# Altium schematic sheet FEV-60_Motor_Driver_Mcu.SchDoc
size B
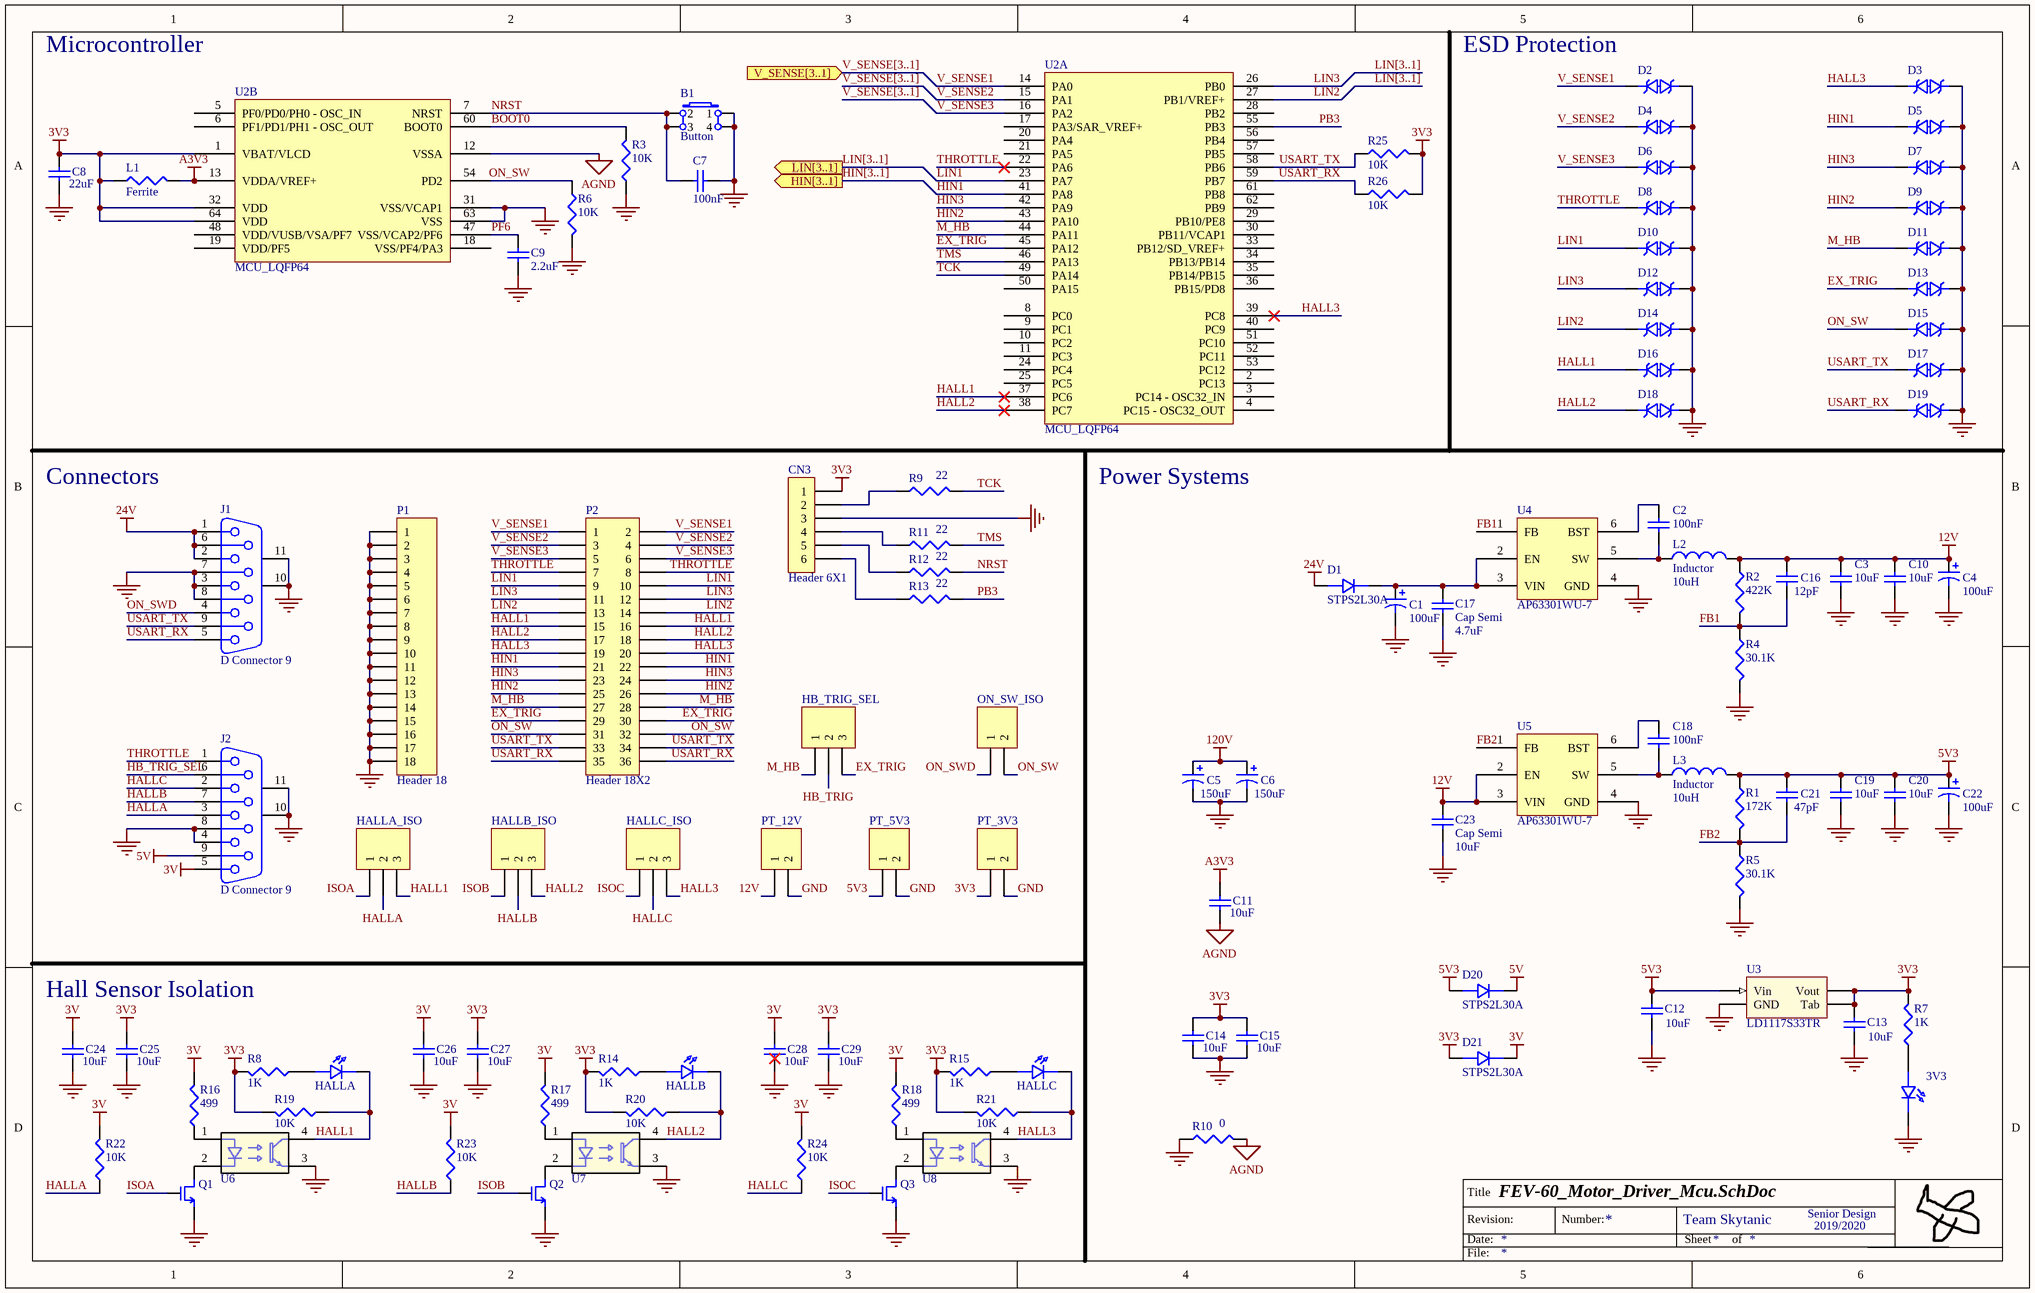
[diagram p0: FEV-60_Motor_Driver_Mcu.SchDoc]

## Parts
3V3  LED-RED-AK-2  [AVAG-HSMX-C190_V]  (value not drawn)
B1  Button  [Button - duplicate]
C1  value 100uF  [UVY1V101MED1TD]  (hidden comment: UVY1V101MED1TD)
C2  value 100nF  [1608[0603]]  (hidden comment: Cap Semi)
C3  value 10uF  [1608[0603]]  (hidden comment: Cap Semi)
C4  value 100uF  [UVY1V101MED1TD]  (hidden comment: UVY1V101MED1TD)
C5  value 150uF  [UCS2D151MHD1TN]  (hidden comment: UCS2D151MHD1TN)
C6  value 150uF  [UCS2D151MHD1TN]  (hidden comment: UCS2D151MHD1TN)
C7  value 100nF  [1608[0603]]  (hidden comment: Cap Semi)
C8  value 22uF  [1608[0603]]  (hidden comment: Cap Semi)
C9  value 2.2uF  [1608[0603]]  (hidden comment: Cap Semi)
C10  value 10uF  [1608[0603]]  (hidden comment: Cap Semi)
C11  value 10uF  [1608[0603]]  (hidden comment: Cap Semi)
C12  value 10uF  [1608[0603]]  (hidden comment: Cap Semi)
C13  value 10uF  [1608[0603]]  (hidden comment: Cap Semi)
C14  value 10uF  [1608[0603]]  (hidden comment: Cap Semi)
C15  value 10uF  [1608[0603]]  (hidden comment: Cap Semi)
C16  value 12pF  [1608[0603]]  (hidden comment: Cap Semi)
C17  Cap Semi  value 4.7uF  [1608[0603]]
C18  value 100nF  [1608[0603]]  (hidden comment: Cap Semi)
C19  value 10uF  [1608[0603]]  (hidden comment: Cap Semi)
C20  value 10uF  [1608[0603]]  (hidden comment: Cap Semi)
C21  value 47pF  [1608[0603]]  (hidden comment: Cap Semi)
C22  value 100uF  [UVY1V101MED1TD]  (hidden comment: UVY1V101MED1TD)
C23  Cap Semi  value 10uF  [1608[0603]]
C24  value 10uF  [1608[0603]]  (hidden comment: Cap Semi)
C25  value 10uF  [1608[0603]]  (hidden comment: Cap Semi)
C26  value 10uF  [1608[0603]]  (hidden comment: Cap Semi)
C27  value 10uF  [1608[0603]]  (hidden comment: Cap Semi)
C28  value 10uF  [1608[0603]]  (hidden comment: Cap Semi)
C29  value 10uF  [1608[0603]]  (hidden comment: Cap Semi)
CN3  Header 6X1  [HDR1X6]
D1  STPS2L30A  [STPS2L30A]
D2  SP1103C-01UTG  [SP1103C-01UTG]  (value not drawn)
D3  SP1103C-01UTG  [SP1103C-01UTG]  (value not drawn)
D4  SP1103C-01UTG  [SP1103C-01UTG]  (value not drawn)
D5  SP1103C-01UTG  [SP1103C-01UTG]  (value not drawn)
D6  SP1103C-01UTG  [SP1103C-01UTG]  (value not drawn)
D7  SP1103C-01UTG  [SP1103C-01UTG]  (value not drawn)
D8  SP1103C-01UTG  [SP1103C-01UTG]  (value not drawn)
D9  SP1103C-01UTG  [SP1103C-01UTG]  (value not drawn)
D10  SP1103C-01UTG  [SP1103C-01UTG]  (value not drawn)
D11  SP1103C-01UTG  [SP1103C-01UTG]  (value not drawn)
D12  SP1103C-01UTG  [SP1103C-01UTG]  (value not drawn)
D13  SP1103C-01UTG  [SP1103C-01UTG]  (value not drawn)
D14  SP1103C-01UTG  [SP1103C-01UTG]  (value not drawn)
D15  SP1103C-01UTG  [SP1103C-01UTG]  (value not drawn)
D16  SP1103C-01UTG  [SP1103C-01UTG]  (value not drawn)
D17  SP1103C-01UTG  [SP1103C-01UTG]  (value not drawn)
D18  SP1103C-01UTG  [SP1103C-01UTG]  (value not drawn)
D19  SP1103C-01UTG  [SP1103C-01UTG]  (value not drawn)
D20  STPS2L30A  [STPS2L30A]
D21  STPS2L30A  [STPS2L30A]
HALLA  LED-RED-AK-2  [AVAG-HSMX-C190_V]  (value not drawn)
HALLA_ISO  Header 3  [HDR1X3]  (value not drawn)
HALLB  LED-RED-AK-2  [AVAG-HSMX-C190_V]  (value not drawn)
HALLB_ISO  Header 3  [HDR1X3]  (value not drawn)
HALLC  LED-RED-AK-2  [AVAG-HSMX-C190_V]  (value not drawn)
HALLC_ISO  Header 3  [HDR1X3]  (value not drawn)
HB_TRIG_SEL  Header 3  [HDR1X3]  (value not drawn)
J1  D Connector 9  [DSUB1.385-2H9]
J2  D Connector 9  [DSUB1.385-2H9]
L1  Ferrite  [J1-0603]
L2  Inductor  value 10uH  [74404084100]
L3  Inductor  value 10uH  [74404084100]
ON_SW_ISO  Header 2  [HDR1X2]  (value not drawn)
P1  Header 18  [HDR1X18]
P2  Header 18X2  [HDR2X18]
PT_3V3  Header 2  [HDR1X2]  (value not drawn)
PT_5V3  Header 2  [HDR1X2]  (value not drawn)
PT_12V  Header 2  [HDR1X2]  (value not drawn)
Q1  RK7002BMT116  [SOT95P240X120-3N]  (value not drawn)
Q2  RK7002BMT116  [SOT95P240X120-3N]  (value not drawn)
Q3  RK7002BMT116  [SOT95P240X120-3N]  (value not drawn)
R1  value 172K  [J1-0603]  (hidden comment: Res3)
R2  value 422K  [J1-0603]  (hidden comment: Res3)
R3  value 10K  [J1-0603]  (hidden comment: Res3)
R4  value 30.1K  [J1-0603]  (hidden comment: Res3)
R5  value 30.1K  [J1-0603]  (hidden comment: Res3)
R6  value 10K  [J1-0603]  (hidden comment: Res3)
R7  value 1K  [J1-0603]  (hidden comment: Res3)
R8  value 1K  [J1-0603]  (hidden comment: Res3)
R9  value 22  [J1-0603]  (hidden comment: Res3)
R10  value 0  [J1-0603]  (hidden comment: Res3)
R11  value 22  [J1-0603]  (hidden comment: Res3)
R12  value 22  [J1-0603]  (hidden comment: Res3)
R13  value 22  [J1-0603]  (hidden comment: Res3)
R14  value 1K  [J1-0603]  (hidden comment: Res3)
R15  value 1K  [J1-0603]  (hidden comment: Res3)
R16  value 499  [J1-0603]  (hidden comment: Res3)
R17  value 499  [J1-0603]  (hidden comment: Res3)
R18  value 499  [J1-0603]  (hidden comment: Res3)
R19  value 10K  [J1-0603]  (hidden comment: Res3)
R20  value 10K  [J1-0603]  (hidden comment: Res3)
R21  value 10K  [J1-0603]  (hidden comment: Res3)
R22  value 10K  [J1-0603]  (hidden comment: Res3)
R23  value 10K  [J1-0603]  (hidden comment: Res3)
R24  value 10K  [J1-0603]  (hidden comment: Res3)
R25  value 10K  [J1-0603]  (hidden comment: Res3)
R26  value 10K  [J1-0603]  (hidden comment: Res3)
U2  MCU_LQFP64  [STM32F030R8 - duplicate]  (parts A,B of 2)
U3  LD1117S33TR  [LD1117S33TR - duplicate]
U4  AP63301WU-7  [AP63301WU-7]
U5  AP63301WU-7  [AP63301WU-7]
U6  TLP291(BLL-TP,SE  [Toshiba_11-11F1_0 - duplicate]  (value not drawn)
U7  TLP291(BLL-TP,SE  [Toshiba_11-11F1_0 - duplicate]  (value not drawn)
U8  TLP291(BLL-TP,SE  [Toshiba_11-11F1_0 - duplicate]  (value not drawn)

## Ports
HIN[3..1] (out), LIN[3..1] (out), V_SENSE[3..1] (in)

## Nets
3V: C24.2 C26.2 C28.2 D21.2(K) J2.5 R16.2 R17.2 R18.2 R22.2 R23.2 R24.2
3V3: C8.2 C13.2 C14.2 C15.2 C25.2 C27.2 C29.2 CN3.1 D21.1(A) L1.1 PT_3V3.1 R7.2 R8.2 R14.2 R15.2 R19.2 R20.2 R21.2 R25.2 R26.2 U2.1(VBAT/VLCD) U2.32(VDD) U2.64(VDD) U3.2(Vout) U3.4(Tab)
5V: D20.2(K) J2.9
5V3: C12.2 C19.2 C20.2 C21.2 C22.1 D20.1(A) L3.2 PT_5V3.1 R1.1 U3.3(Vin)
12V: C3.2 C4.1 C10.2 C16.2 C23.2 L2.2 PT_12V.1 R2.1 U5.2(EN) U5.3(VIN)
24V: D1.1(A) J1.1 J1.2 J1.6
120V: C5.1 C6.1
A3V3: C11.2 L1.2 U2.13(VDDA/VREF+)
AGND: C11.1 R10.2 U2.12(VSSA)
GND: 3V3.2(K) B1.1 B1.4 C1.2 C3.1 C4.2 C5.2 C6.2 C7.1 C8.1 C9.1 C10.1 C12.1 C13.1 C14.1 C15.1 C17.1 C19.1 C20.1 C22.2 C23.1 C24.1 C25.1 C26.1 C27.1 C28.1 C29.1 CN3.3 D2.2(K) D3.2(K) D4.2(K) D5.2(K) D6.2(K) D7.2(K) D8.2(K) D9.2(K) D10.2(K) D11.2(K) D12.2(K) D13.2(K) D14.2(K) D15.2(K) D16.2(K) D17.2(K) D18.2(K) D19.2(K) J1.3 J1.7 J1.8 J1.10(MH1) J1.11(MH2) J2.4 J2.8 J2.10(MH1) J2.11(MH2) P1.1 P1.2 P1.3 P1.4 P1.5 P1.6 P1.7 P1.8 P1.9 P1.10 P1.11 P1.12 P1.13 P1.14 P1.15 P1.16 P1.17 P1.18 PT_3V3.2 PT_5V3.2 PT_12V.2 Q1.2(SOURCE) Q2.2(SOURCE) Q3.2(SOURCE) R3.1 R4.2 R5.2 R6.2 R10.1 U2.31(VSS/VCAP1) U2.63(VSS) U3.1(GND) U4.4(GND) U5.4(GND) U6.3(Emmiter) U7.3(Emmiter) U8.3(Emmiter)
BOOT0: R3.2 U2.60(BOOT0)
EX_TRIG: D13.1(A) HB_TRIG_SEL.3 P2.29 P2.30 U2.45(PA12)
FB1: C16.1 R2.2 R4.1 U4.1(FB)
FB2: C21.1 R1.2 R5.1 U5.1(FB)
HALL1: D16.1(A) HALLA.2(K) HALLA_ISO.3 P2.15 P2.16 R19.1 U2.37(PC6) U6.4(Collector)
HALL2: D18.1(A) HALLB.2(K) HALLB_ISO.3 P2.17 P2.18 R20.1 U2.38(PC7) U7.4(Collector)
HALL3: D3.1(A) HALLC.2(K) HALLC_ISO.3 P2.19 P2.20 R21.1 U2.39(PC8) U8.4(Collector)
HALLA: HALLA_ISO.2 J2.3 R22.1
HALLB: HALLB_ISO.2 J2.7 R23.1
HALLC: HALLC_ISO.2 J2.2 R24.1
HB_TRIG: HB_TRIG_SEL.2
HB_TRIG_SEL: J2.6
HIN1: D5.1(A) P2.21 P2.22 U2.41(PA8)
HIN2: D9.1(A) P2.25 P2.26 U2.43(PA10)
HIN3: D7.1(A) P2.23 P2.24 U2.42(PA9)
ISOA: HALLA_ISO.1 Q1.1(GATE)
ISOB: HALLB_ISO.1 Q2.1(GATE)
ISOC: HALLC_ISO.1 Q3.1(GATE)
LIN1: D10.1(A) P2.9 P2.10 U2.23(PA7)
LIN2: D14.1(A) P2.13 P2.14 U2.27(PB1/VREF+)
LIN3: D12.1(A) P2.11 P2.12 U2.26(PB0)
M_HB: D11.1(A) HB_TRIG_SEL.1 P2.27 P2.28 U2.44(PA11)
NRST: B1.2 B1.3 C7.2 R12.2 U2.7(NRST)
ON_SW: D15.1(A) ON_SW_ISO.2 P2.31 P2.32 R6.1 U2.54(PD2)
ON_SWD: J1.4 ON_SW_ISO.1
PB3: R13.2 U2.55(PB3)
PF6: C9.2 U2.47(VSS/VCAP2/PF6)
TCK: R9.2 U2.49(PA14)
THROTTLE: D8.1(A) J2.1 P2.7 P2.8 U2.22(PA6)
TMS: R11.2 U2.46(PA13)
USART_RX: D19.1(A) J1.5 P2.35 P2.36 R26.1 U2.59(PB7)
USART_TX: D17.1(A) J1.9 P2.33 P2.34 R25.1 U2.58(PB6)
V_SENSE1: D2.1(A) P2.1 P2.2 U2.14(PA0)
V_SENSE2: D4.1(A) P2.3 P2.4 U2.15(PA1)
V_SENSE3: D6.1(A) P2.5 P2.6 U2.16(PA2)
Net3V3_1: 3V3.1(A) R7.1
NetC1_1: C1.1 C17.2 D1.2(K) U4.2(EN) U4.3(VIN)
NetC2_1: C2.1 L2.1 U4.5(SW)
NetC2_2: C2.2 U4.6(BST)
NetC18_1: C18.1 L3.1 U5.5(SW)
NetC18_2: C18.2 U5.6(BST)
NetCN3_2: CN3.2 R9.1
NetCN3_4: CN3.4 R11.1
NetCN3_5: CN3.5 R12.1
NetCN3_6: CN3.6 R13.1
NetHALLA_1: HALLA.1(A) R8.1
NetHALLB_1: HALLB.1(A) R14.1
NetHALLC_1: HALLC.1(A) R15.1
NetQ1_3: Q1.3(DRAIN) U6.2(Cathode)
NetQ2_3: Q2.3(DRAIN) U7.2(Cathode)
NetQ3_3: Q3.3(DRAIN) U8.2(Cathode)
NetR16_1: R16.1 U6.1(Anode)
NetR17_1: R17.1 U7.1(Anode)
NetR18_1: R18.1 U8.1(Anode)

Not connected (* = marked no-connect by the designer): U2 2(PC13) 3(PC14_-_OSC32_IN) 4(PC15_-_OSC32_OUT) 5(PF0/PD0/PH0_-_OSC_IN) 6(PF1/PD1/PH1_-_OSC_OUT) 8(PC0) 9(PC1) 10(PC2) 11(PC3) 17(PA3/SAR_VREF+) 18(VSS/PF4/PA3) 19(VDD/PF5) 20(PA4) 21(PA5) 24(PC4) 25(PC5) 28(PB2) 29(PB10/PE8) 30(PB11/VCAP1) 33(PB12/SD_VREF+) 34(PB13/PB14) 35(PB14/PB15) 36(PB15/PD8) 40(PC9) 48(VDD/VUSB/VSA/PF7) 50(PA15) 51(PC10) 52(PC11) 53(PC12) 56(PB4) 57(PB5) 61(PB8) 62(PB9)

## Buses and harness runs
bus HIN[3..1] = port HIN[3..1]
bus LIN[3..1]
bus LIN[3..1] = port LIN[3..1]
bus V_SENSE[3..1]
bus V_SENSE[3..1] = port V_SENSE[3..1]

## Notes on the sheet
- Microcontroller
- (near D2) ESD Protection
- Connectors
- Power Systems
- Hall Sensor Isolation
- Title
- Date:
- Revision:
- Number:
- Team Skytanic
- Sheet
- of
- Senior Design
- 2019/2020
- File:

## Library data of the parts
C1 C4 C22 = UVY1V101MED1TD: Polarized Capacitor (Axial); Published: 8-Jun-2000; LatestRevisionDate: 17-Jul-2002; LatestRevisionNote: Re-released for DXP Platform.; PackageReference: POLAR0.8; Publisher: Altium Limited; PackageDescription: Polarized Capacitor; 2 Leads
C2 C3 C7-C21 C23-C29 = Cap Semi: Capacitor (Semiconductor SIM Model); Published: 8-Jun-2000; LatestRevisionDate: 29-May-2009; LatestRevisionNote: IPC-7351 Footprint Added.; PackageReference: C1206; Publisher: Altium Limited; PackageDescription: Chip Capacitor
C5 C6 = UCS2D151MHD1TN: Polarized Capacitor (Axial); Published: 8-Jun-2000; LatestRevisionDate: 17-Jul-2002; LatestRevisionNote: Re-released for DXP Platform.; PackageReference: POLAR0.8; Publisher: Altium Limited; PackageDescription: Polarized Capacitor; 2 Leads
CN3 = Header 6X1: Header, 6-Pin, Single row; LatestRevisionDate: 17-Jul-2002; LatestRevisionNote: Re-released for DXP Platform.; Publisher: Altium Limited
D1 D20 D21 = STPS2L30A: Manuf_1: STM; Provided: ST; Order: BAT60JFILM; ECCN_US/EU: EAR99/NEC; Revision: July-2002: Re-released for DXP Platform.; Manuf_Part_1: BAT60JFILM; Distrib: ST
D2-D19 = SP1103C-01UTG: 9V (Typ) Clamp 80A (8/20µs) Ipp Tvs Diode Surface Mount 2-DFN (1.6x1); Manuf: Littelfuse Inc.; Order: F10154CT-ND; Purchase Link: https://www.digikey.com/product-detail/en/littelfuse-inc/SP1103C-01UTG/F10154CT-ND/7402659; Manuf_Part_Num: SP1103C-01UTG; Distrib: Digi-Key; Package: 0603/2-DFN
HALLA_ISO HALLB_ISO HALLC_ISO HB_TRIG_SEL = Header 3: Header, 3-Pin; LatestRevisionDate: 17-Jul-2002; LatestRevisionNote: Re-released for DXP Platform.; Publisher: Altium Limited
J1 J2 = D Connector 9: Receptacle Assembly, 9 Position, Right Angle; PackageDocument: O; Positions: 9; Published: 15-Jun-2001; LatestRevisionDate: 17-Jul-2002; LatestRevisionNote: Re-released for DXP Platform.; DatasheetDocument: 1-Sep-1999; PackageReference: 788750; Publisher: Altium Limited; Orientation: Right Angle; Gender: Receptacle
L1 R1-R26 = Res3: Resistor; Published: 8-Jun-2000; LatestRevisionDate: 29-May-2009; LatestRevisionNote: IPC-7351 Footprint Added.; PackageReference: J1-0603; Publisher: Altium Limited; PackageDescription: Chip Resistor
L2 L3 = Inductor: Code_IEC: 1005; Published: 8-Jun-2000; LatestRevisionDate: 29-May-2009; LatestRevisionNote: IPC-7351 Footprint Added.; PackageReference: 0402-A; Publisher: Altium Limited; PackageDescription: Chip Inductor; Code_JEITA: 0402
ON_SW_ISO PT_3V3 PT_5V3 PT_12V = Header 2: Header, 2-Pin; LatestRevisionDate: 17-Jul-2002; LatestRevisionNote: Re-released for DXP Platform.; Publisher: Altium Limited
P1 = Header 18: Header, 18-Pin; LatestRevisionDate: 17-Jul-2002; LatestRevisionNote: Re-released for DXP Platform.; Publisher: Altium Limited
P2 = Header 18X2: Header, 18-Pin, Dual row; LatestRevisionDate: 17-Jul-2002; LatestRevisionNote: Re-released for DXP Platform.; Publisher: Altium Limited
Q1-Q3 = RK7002BMT116: MOSFET N-CH 60V 0.25A SST3
U4 U5 = AP63301WU-7: Buck Switching Regulator IC Positive Adjustable 0.8V 1 Output 3A SOT-23-6 Thin, TSOT-23-6; ComponentLink1Description: Digikey; ComponentLink1URL: https://www.digikey.com/product-detail/en/diodes-incorporated/AP63301WU-7/31-AP63301WU-7CT-ND/10492238
U6-U8 = TLP291(BLL-TP,SE: Optoisolator Transistor Output 3750Vrms 1 Channel 4-SO; Datasheet: https://toshiba.semicon-storage.com/info/docget.jsp?did=14152&prodName=TLP291(SE; Digikey Part Number: TLP291(BLL-TPSECT-ND; Digikey Order Link: https://www.digikey.com/product-detail/en/toshiba-semiconductor-and-storage/TLP291-BLL-TP-SE/TLP291-BLL-TPSECT-ND/4562947